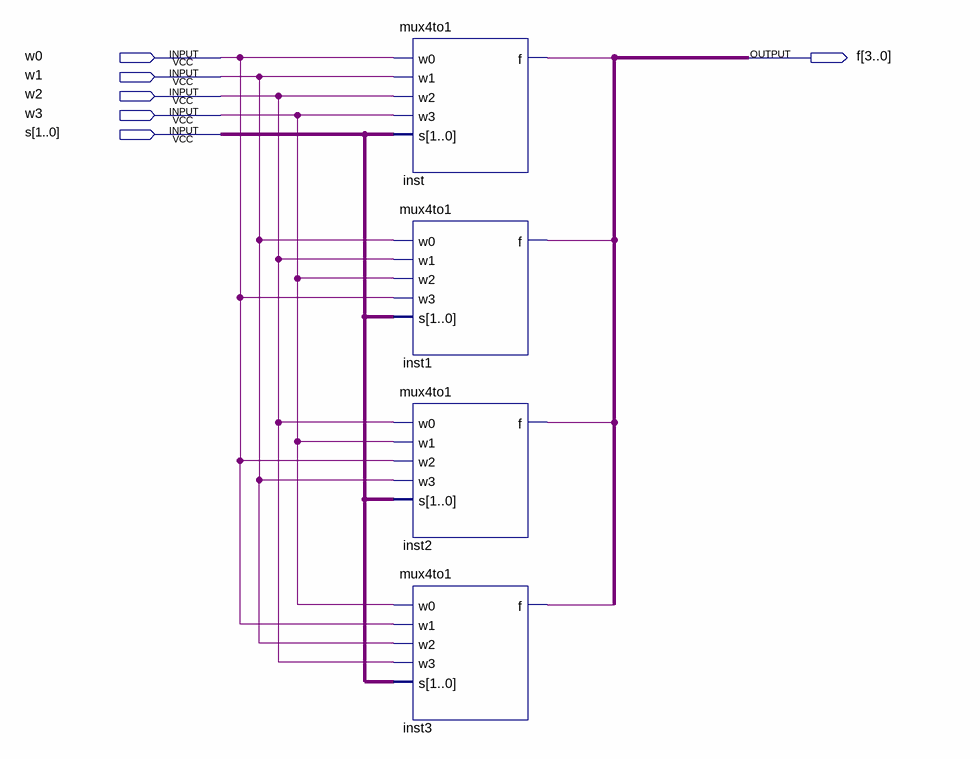
[diagram p0: schematic sheet]
// Quartus schematic mux4to1.bdf as structural Verilog: 4 symbols, 6 pins
module mux4to1 (
  input  w0,
  input  w1,
  input  w2,
  input  w3,
  input  [1:0] s,
  output [3:0] f
);

  wire inst1_f, inst2_f, inst3_f, inst_f;

  mux4to1 inst (.w0(w0), .w1(w1), .w2(w2), .w3(w3), .s(s), .f(inst_f));
  mux4to1 inst1 (.w0(w1), .w1(w2), .w2(w3), .w3(w0), .s(s), .f(inst1_f));
  mux4to1 inst2 (.w0(w2), .w1(w3), .w2(w0), .w3(w1), .s(s), .f(inst2_f));
  mux4to1 inst3 (.w0(w3), .w1(w0), .w2(w1), .w3(w2), .s(s), .f(inst3_f));
endmodule
